# EAGLE design mkuBoard-044-3B (EAGLE 7.5.0)
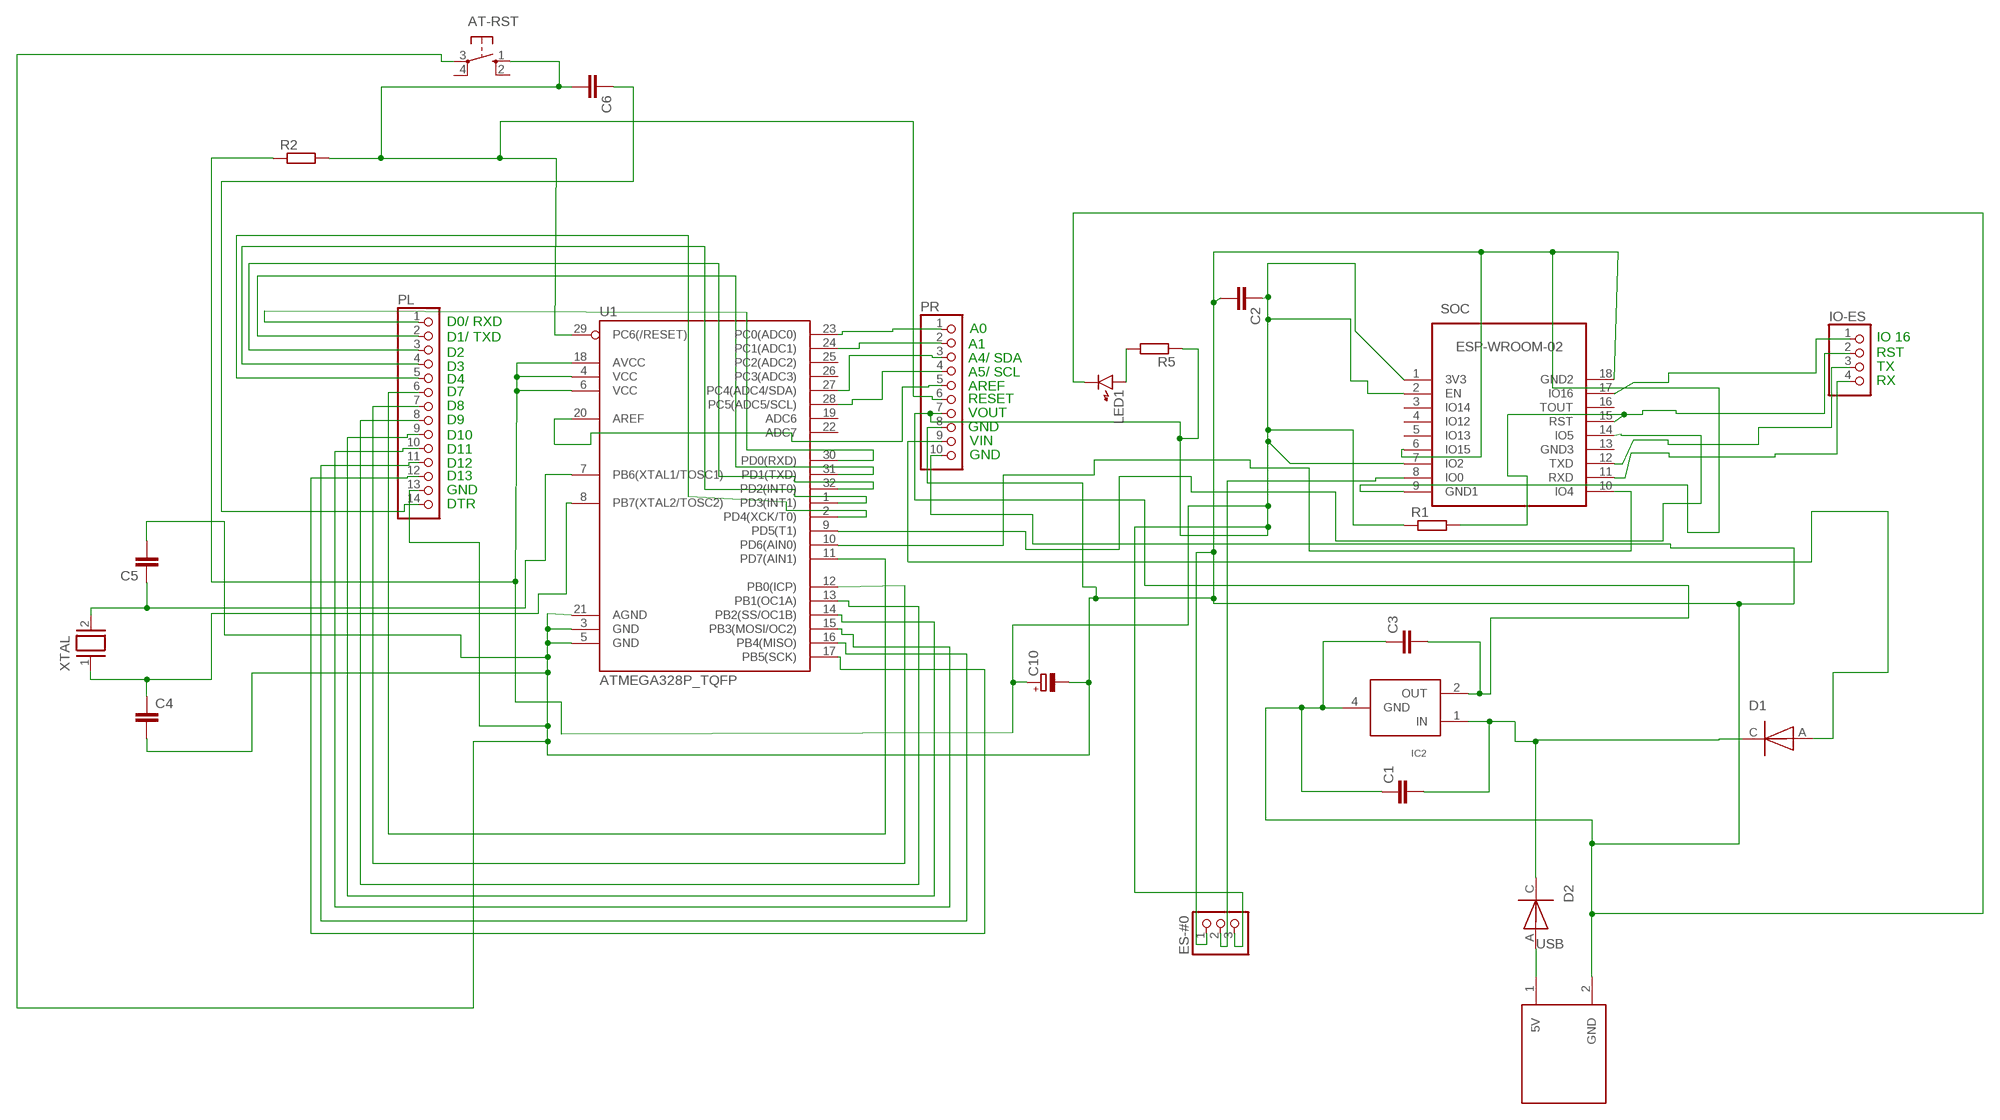
[diagram p0: schematic, sheet 1]

## Parts
AT-RST  10-XX  [B3F-10XX]
C1  C-EUC0603  [C0603]
C2  C-EUC0603  [C0603]
C3  C-EUC1206  [C1206]
C4  C-EUC0603  [C0603]
C5  C-EUC0603  [C0603]
C6  C-EUC0603  [C0603]
C10  CPOL-EU153CLV-0605  [153CLV-0605]
D1  DIODE-EX  [SOD80C]
D2  DIODE-EX  [SOD80C]
ES-#0  PINHD-1X3  [1X03]
IC2  NJM2845DL1  [NJM2845DL1-PKG]
IO-ES  PINHD-1X4  [1X04]
LED1  LED1608  [LED1608]
PL  PINHD-1X14  [1X14]
PR  PINHD-1X10  [1X10]
R1  R-EU_R0603  [R0603]
R2  R-EU_R0603  [R0603]
R5  R-EU_R0603  [R0603]
SOC  ESP-WROOM-02  ESP-WROOM-02-CP2FRONT  [FRONT-FACE-CP2]
U1  ATMEGA328P_TQFP  [TQFP32-08]
USB  USB-CUST-1  [USB-CUST-1-PKG]
XTAL  XTAL/S  [QS]

## Nets
N$1: ES-#0.2 SOC.8(IO0)
N$2: PL.1 U1.30(PD0(RXD))
N$3: SOC.14(IO5) U1.9(PD5(T1))
N$4: IO-ES.2 R1.2 SOC.15(RST)
N$5: C1.2 D1.C D2.C IC2.1(IN)
N$6: IO-ES.1 SOC.17(IO16)
N$7: D1.A PR.9
N$8: PR.3 U1.27(PC4(ADC4/SDA))
N$9: IO-ES.3 SOC.12(TXD)
N$10: IO-ES.4 SOC.11(RXD)
N$11: PR.4 U1.28(PC5(ADC5/SCL))
N$12: D2.A USB.1(5V)
N$16: C2.1 C3.2 C10.+ ES-#0.3 IC2.2(OUT) PR.7 R1.1 R2.1 R5.1 SOC.1(3V3) SOC.2(EN) SOC.7(IO2) U1.4(VCC) U1.6(VCC) U1.18(AVCC)
N$18: C6.1 PL.14
N$19: PL.2 U1.31(PD1(TXD))
N$20: PL.3 U1.32(PD2(INT0))
N$21: PL.4 U1.1(PD3(INT1))
N$22: PL.5 U1.2(PD4(XCK/T0))
N$23: LED1.A R5.2
N$24: SOC.10(IO4) U1.10(PD6(AIN0))
N$25: PL.6 U1.11(PD7(AIN1))
N$26: PL.7 U1.12(PB0(ICP))
N$27: PL.8 U1.13(PB1(OC1A))
N$28: PL.9 U1.14(PB2(SS/OC1B))
N$29: PL.10 U1.15(PB3(MOSI/OC2))
N$30: PL.11 U1.16(PB4(MISO))
N$31: PL.12 U1.17(PB5(SCK))
N$32: PR.1 U1.23(PC0(ADC0))
N$33: PR.2 U1.24(PC1(ADC1))
N$34: AT-RST.1(S) C6.2 PR.6 R2.2 U1.29(PC6(/RESET))
N$36: AT-RST.3(P) C1.1 C2.2 C3.1 C4.2 C5.2 C10.- ES-#0.1 IC2.4(GND) LED1.K PL.13 PR.8 PR.10 SOC.6(IO15) SOC.9(GND1) SOC.18(GND2) U1.3(GND) U1.5(GND) U1.21(AGND) USB.2(GND)
N$38: PR.5 U1.20(AREF)
N$40: C5.1 U1.7(PB6(XTAL1/TOSC1)) XTAL.2
N$41: C4.1 U1.8(PB7(XTAL2/TOSC2)) XTAL.1
Unconnected: AT-RST.2(S1) AT-RST.4(P1) SOC.3(IO14) SOC.4(IO12) SOC.5(IO13) SOC.13(GND3) SOC.16(TOUT) U1.19(ADC6) U1.22(ADC7) U1.25(PC2(ADC2)) U1.26(PC3(ADC3))

## Notes on the sheet
- D0/ RXD
- A0
- D1/ TXD | IO 16
- A1
- D2 | RST
- A4/ SDA
- D3 | TX
- A5/ SCL
- D4 | RX
- AREF
- D7
- RESET
- D8
- VOUT
- D9
- GND
- D10
- VIN
- D11
- GND
- D12
- D13
- GND
- DTR

## Library data of the parts
AT-RST = switch-omron:10-XX: OMRON SWITCH; MPN: B3F-1000; OC_FARNELL: 176432; OC_NEWARK: 36M3542
C1-C6 = resistor:C-EU: CAPACITOR, European symbol
C10 = rcl:CPOL-EU: POLARIZED CAPACITOR, European symbol
D1 D2 = diode-ex2:DIODE-EX
ES-#0 = pinhead:PINHD-1X3: PIN HEADER
IC2 = ic-cust-4:NJM2845DL1
IO-ES = pinhead:PINHD-1X4: PIN HEADER
LED1 = generic:LED: Generic LEDs
PL = pinhead:PINHD-1X14: PIN HEADER
PR = pinhead:PINHD-1X10: PIN HEADER
R1 R2 R5 = resistor:R-EU_: RESISTOR, European symbol
SOC = esp-wroom-02-CP2:ESP-WROOM-02-CP2: WiFi module - ESP-WROOM-02
U1 = SparkFun-DigitalIC:ATMEGA328P_TQFP; PROD_ID: IC-09069
USB = usb-cust-2:USB-CUST-1
XTAL = special:XTAL/S: CRYSTAL

## Board
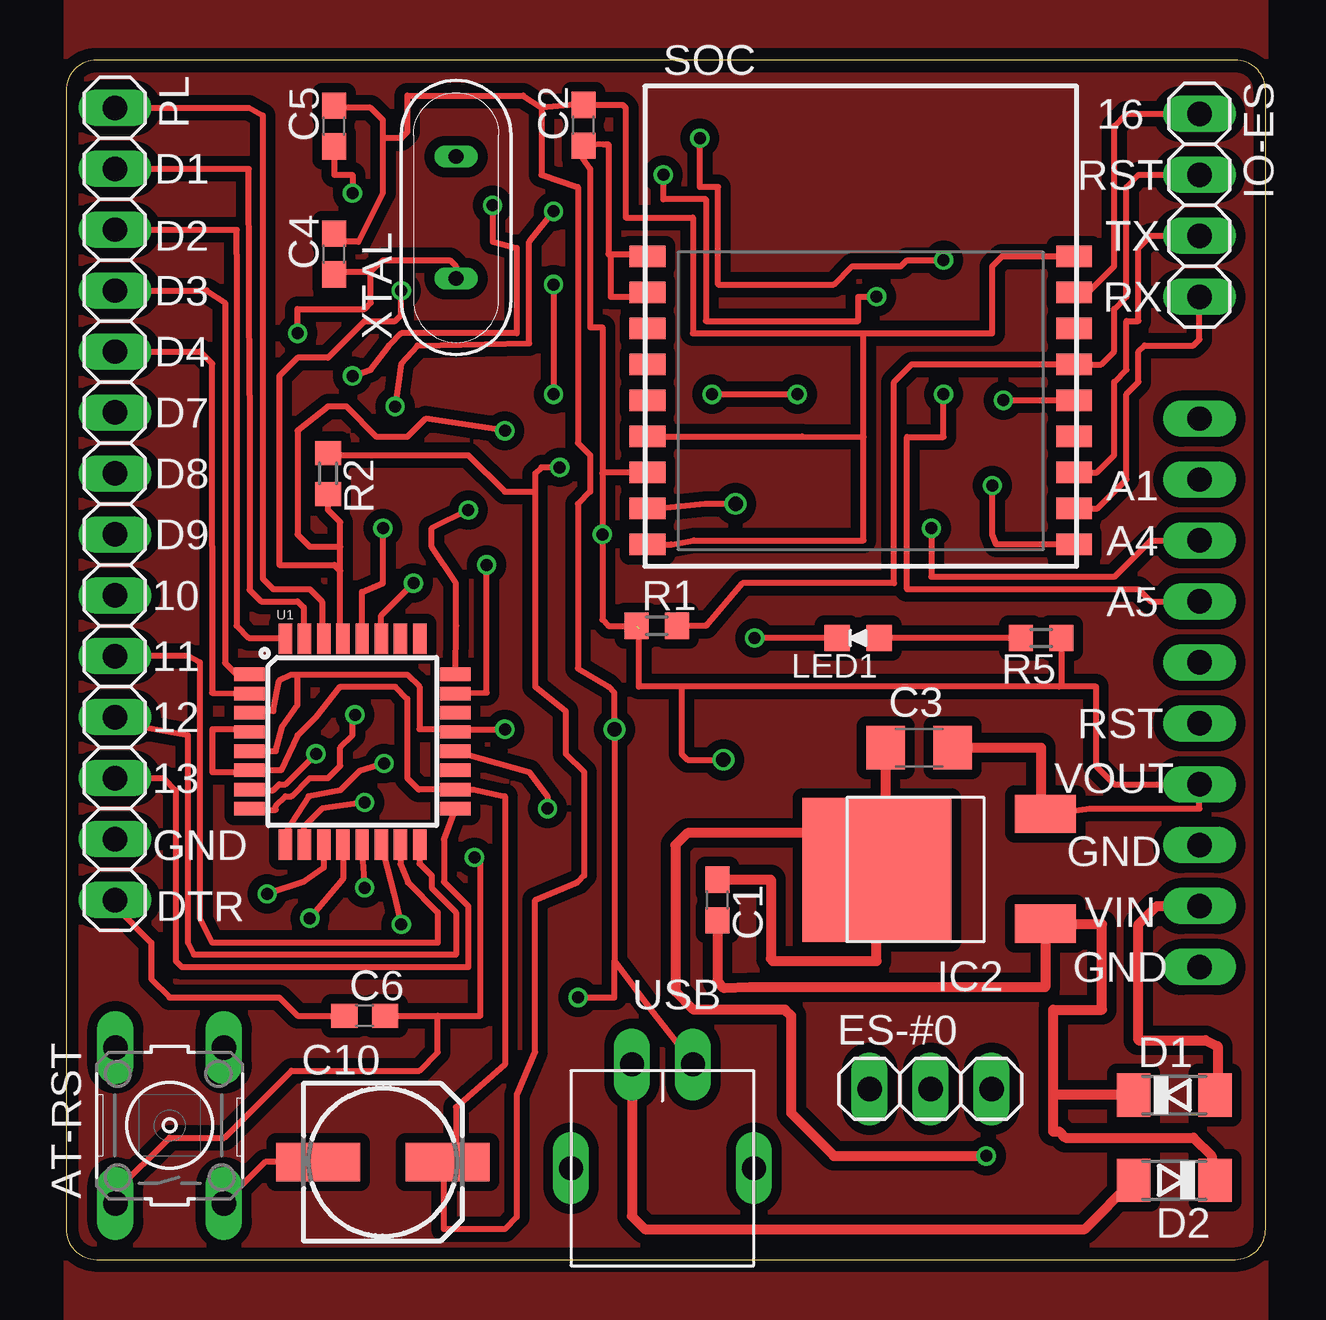
[diagram p1: board, top side]
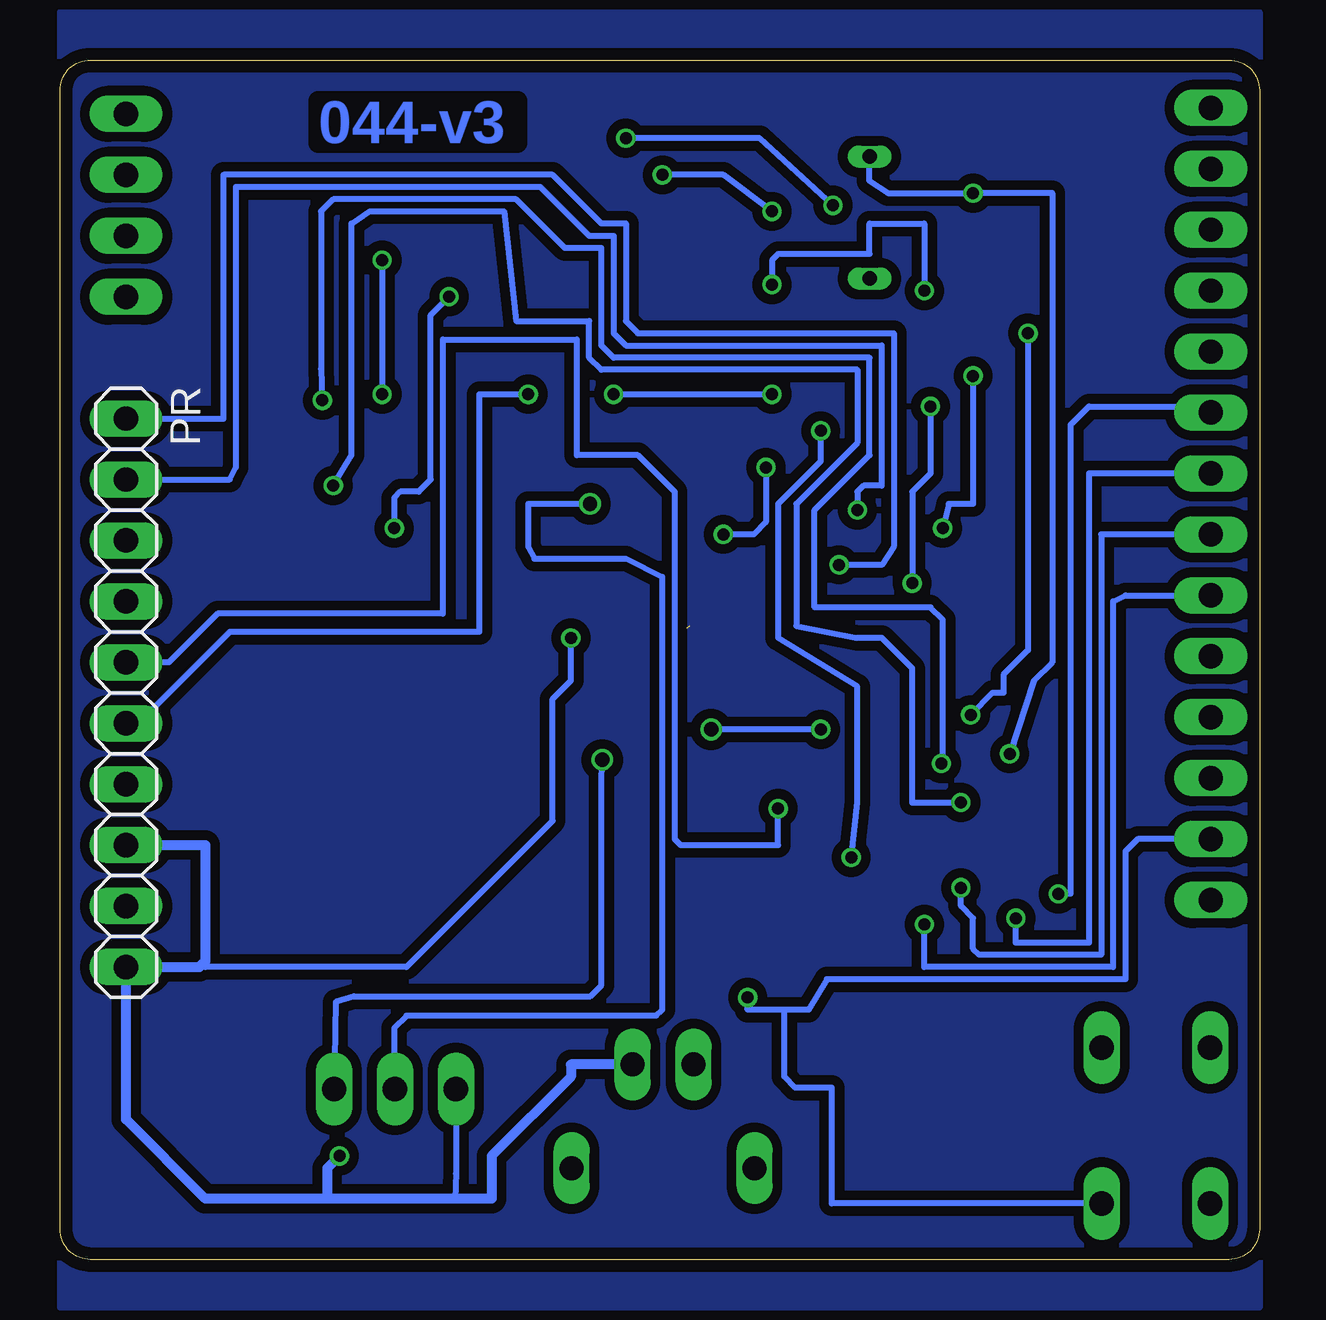
[diagram p2: board, bottom side, seen from below]

Size 50 x 50 mm. Coordinates in mm from the lower left corner, seen from the top.
Outline: 50,1.27 50,48.73 arc90 48.73,50 1.27,50 arc90 0,48.73 0,1.27 arc90 1.27,0 48.73,0 arc90 50,1.27
Copper layers (1*16): Top 0.035mm / dielectric 1.6mm / Bottom 0.035mm
Design rules "Elecrow_2-layer_PCB_eagle_rule": minimum track width 6mil, minimum drill 12mil, track to track 6mil, track to pad 6mil, pad to pad 6mil, via to via 8mil, smd to smd 0mil, copper to edge 20mil, drill to drill 10mil, minimum pad ring 6mil, minimum via ring 6mil, stop-mask expansion 0mil, vias tented up to drill 100mil, thermal gap 10mil

### Footprints (pad centres in the part's own frame; a part is rotated, then mirrored left to right if it is on the bottom)
B3F-10XX = drill 1.016 long: 1 -3.251,2.261; 2 3.251,2.261; 3 -3.251,-2.261; 4 3.251,-2.261
C0603 = smd 1.1 x 1: 1 -0.85,0; 2 0.85,0
C1206 = smd 1.6 x 1.8: 1 -1.4,0; 2 1.4,0
153CLV-0605 = smd 3.5 x 1.6: + 2.7,0; - -2.7,0
SOD80C = smd 1.4 x 1.8: A 1.7,0; C -1.7,0
1X03 = drill 1.016 long: 1 -2.54,0; 2 0,0; 3 2.54,0
NJM2845DL1-PKG = smd 2.54 x 1.6: 1 -4.27,2.254; 2 -4.27,-2.318 | smd 6.2 x 6: 4 2.746,0.016
1X04 = drill 1.016 long: 1 -3.81,0; 2 -1.27,0; 3 1.27,0; 4 3.81,0
LED1608 = smd 1.05 x 1.08: A -0.875,0; K 0.875,0
1X14 = drill 1.016 long: 1 -16.51,0; 2 -13.97,0; 3 -11.43,0; 4 -8.89,0; 5 -6.35,0; 6 -3.81,0; 7 -1.27,0; 8 1.27,0; 9 3.81,0; 10 6.35,0; 11 8.89,0; 12 11.43,0; 13 13.97,0; 14 16.51,0
1X10 = drill 1.016 long: 1 -11.43,0; 2 -8.89,0; 3 -6.35,0; 4 -3.81,0; 5 -1.27,0; 6 1.27,0; 7 3.81,0; 8 6.35,0; 9 8.89,0; 10 11.43,0
R0603 = smd 1 x 1.1: 1 -0.85,0; 2 0.85,0
FRONT-FACE-CP2 = smd 1.485 x 0.9: 1 -8.893,4.9; 2 -8.893,3.4; 3 -8.893,1.9; 4 -8.893,0.4; 5 -8.893,-1.1; 6 -8.893,-2.6; 7 -8.893,-4.1; 8 -8.893,-5.6; 9 -8.893,-7.1; 10 8.893,-7.1; 11 8.893,-5.6; 12 8.893,-4.1; 13 8.893,-2.6; 14 8.893,-1.1; 15 8.893,0.4; 16 8.893,1.9; 17 8.893,3.4; 18 8.893,4.9
TQFP32-08 = smd 1.27 x 0.559: 1 -4.293,2.8; 2 -4.293,2; 3 -4.293,1.2; 4 -4.293,0.4; 5 -4.293,-0.4; 6 -4.293,-1.2; 7 -4.293,-2; 8 -4.293,-2.8; 17 4.293,-2.8; 18 4.293,-2; 19 4.293,-1.2; 20 4.293,-0.4; 21 4.293,0.4; 22 4.293,1.2; 23 4.293,2; 24 4.293,2.8 | smd 0.559 x 1.27: 9 -2.8,-4.293; 10 -2,-4.293; 11 -1.2,-4.293; 12 -0.4,-4.293; 13 0.4,-4.293; 14 1.2,-4.293; 15 2,-4.293; 16 2.8,-4.293; 25 2.8,4.293; 26 2,4.293; 27 1.2,4.293; 28 0.4,4.293; 29 -0.4,4.293; 30 -1.2,4.293; 31 -2,4.293; 32 -2.8,4.293
USB-CUST-1-PKG = drill 1 long: 1 -1.27,6.604; 2 1.27,6.604; 3 -3.81,2.286; 4 3.81,2.286
QS = drill 0.61 long: 1 -2.54,0; 2 2.54,0

### Placement (x,y rotation side)
AT-RST  4.32,5.59 90 top
C1  27.14,14.99 270 top
C2  21.57,47.28 90 top
C3  35.56,21.34 0 top
C4  11.18,41.91 90 top
C5  11.18,47.24 90 top
C6  12.45,10.16 0 top
C10  13.21,4.06 0 top
D1  46.19,6.86 0 top
D2  46.19,3.3 180 top
ES-#0  36.03,7.11 0 top
IC2  36.54,16.26 180 top
IO-ES  47.24,43.94 270 top
LED1  33.02,25.91 180 top
PL  2.03,31.5 270 top
PR  47.24,23.62 270 bottom
R1  24.62,26.42 0 top
R2  10.92,32.77 270 top
R5  40.64,25.91 180 top
SOC  33.13,36.91 0 top
U1  11.94,21.59 0 top
USB  24.86,1.52 0 top
XTAL  16.26,43.43 90 top

### Tracks (layer width: path | path; a pad name or v marks a point on that pad's centre or on a via)
N$1  (via drill 0.6)
  Top 0.254: v27.91,31.5 26.64,31.5 24.17,31.24 SOC.8
  Bottom 0.254: v27.91,31.5 30.48,31.5 30.48,29.72 30.23,29.21 26.42,29.21 24.89,28.45 24.89,10.41 25.15,10.16 35.56,10.16 36.07,9.65 36.07,7.15 ES-#0.2
N$2
  Top 0.254: PL.1 7.62,48.01 8.2,47.68 8.2,28.38 8.64,27.94 10.16,27.94 10.67,27.43 10.67,25.95 U1.30
N$3  (via drill 0.5)
  Top 0.152: 9.14,17.83 9.14,17.37 U1.9
  Top 0.254: v13.26,20.68 12.24,20.37 11.43,19.56 10.11,19.3 9.14,17.83 | v39.06,35.81 SOC.14
  Bottom 0.254: v39.06,35.81 39.12,37.13 39.12,43.69 38.61,44.2 30.99,44.2 28.96,42.16 27.43,42.16 27.43,38.1 26.92,37.59 16.26,37.59 16.26,33.53 18.54,31.24 18.54,27.18 13.72,27.18 13.21,26.67 13.21,20.73 v13.26,20.68
N$4
  Top 0.254: IO-ES.2 44.7,45.21 44.2,44.7 44.2,40.13 43.69,39.62 43.69,37.85 43.15,37.31 SOC.15 35.24,37.31 34.51,36.58 34.51,28.19 28.19,28.19 26.67,26.42 R1.2
N$5
  Top 0.406: C1.2 27.14,11.6 27.43,11.31 28.49,11.35 40.81,11.35 IC2.1 40.81,13.97 43.18,13.97 43.18,10.41 41.15,10.41 41.15,6.86 | D1.C 41.15,6.86 | 41.15,6.86 41.15,5.33 41.4,5.33 41.66,5.08 46.99,5.08 47.75,4.32 47.75,3.44 D2.C
N$6
  Top 0.254: SOC.17 42.59,40.31 43.69,41.4 43.69,47.24 44.2,47.75 IO-ES.1
N$7
  Top 0.406: PR.9 45.47,14.73 44.7,13.97 44.7,9.14 47.5,9.14 48.01,8.89 48.01,6.97 D1.A
N$8  (via drill 0.5)
  Top 0.254: v20.32,43.69 19.3,42.42 19.3,38.19 14.64,38.1 13.97,37.34 v13.72,35.56 | U1.27 13.14,26.85 v14.48,28.19 | PR.3 45.21,29.97 43.69,28.45 36.07,28.45 v36.07,30.48 | v33.78,40.13 33.02,40.13 33.02,39.12 26.67,39.12 26.67,44.2 24.89,44.2 v24.89,45.21
  Bottom 0.254: v20.32,43.69 22.35,45.21 v24.89,45.21 | v13.72,35.56 13.72,32.77 14.48,32 v14.48,28.19 | v36.07,30.48 36.07,31.75 35.81,32 35.05,32 34.54,32.51 34.54,39.37 v33.78,40.13
N$9
  Top 0.254: 41.58,32.81 SOC.12 42.97,32.81 43.69,33.53 43.69,36.58 44.2,37.08 44.2,39.12 44.7,39.12 44.7,42.16 45.21,42.67 IO-ES.3
N$10
  Top 0.254: SOC.11 42.99,31.31 44.2,32.51 44.2,36.07 44.7,36.58 44.7,37.85 44.96,38.1 46.99,38.1 47.24,38.35 IO-ES.4
N$11  (via drill 0.5)
  Top 0.254: U1.28 12.34,27.83 13.21,28.19 v13.21,30.48 | v11.94,36.83 12.7,37.08 13.46,38.1 13.97,38.61 18.8,38.61 18.8,42.16 17.78,42.42 v17.78,43.94 | v36.58,36.07 36.58,34.29 35.05,34.29 35.05,27.94 44.7,27.94 45.21,27.43 PR.4 | v36.58,41.66 35.05,41.66 34.8,41.4 32.77,41.4 32,40.64 27.18,40.64 27.18,44.7 26.42,44.7 v26.42,46.74
  Bottom 0.254: v17.78,43.94 20.83,46.74 v26.42,46.74 | v36.58,41.66 v36.58,36.07 | v11.94,36.83 11.94,31.5 12.95,31.5 v13.21,30.48
N$12
  Top 0.406: D2.A 42.46,1.27 24.13,1.27 23.59,1.81 USB.1
N$14
  pour Bottom (isolate 0.406, no thermals): 0,52 0,-2 50,-2 50,52
N$16  (via drill 0.5, 0.6)  (1 unrouted)
  Top 0.254: IC2.2 40.81,18.54 42.67,18.8 47.24,18.8 PR.7 43.69,19.81 42.93,20.57 42.93,23.88 41.4,23.88 | U1.4 7.75,22.1 6.1,22.1 6.1,20.32 7.58,20.32 U1.6 8.96,20.39 9.65,21.84 10.41,22.61 11.43,23.88 13.72,23.88 14.22,23.37 14.22,20.07 14.7,19.59 U1.18 16.99,19.59 18.29,19.3 18.29,8.13 16.26,6.35 16.26,4.41 C10.+ 15.75,3.46 15.75,1.27 18.29,1.27 18.8,1.78 18.8,6.86 19.56,8.64 19.56,14.99 21.34,15.75 21.59,16 21.59,20.32 20.83,21.08 20.83,22.86 19.56,23.88 19.56,32 | 24.08,41.66 SOC.1 24.13,41.91 22.61,41.91 | 22.61,41.91 22.61,46.48 22.39,46.48 C2.1 21.34,46.19 21.84,45.47 21.84,38.86 22.35,38.86 22.35,32.77 | SOC.2 23.9,40.13 22.71,40.13 22.71,41.81 22.61,41.91 | 22.35,32.77 v22.35,30.23 22.35,26.67 22.61,26.42 R1.1 | R2.1 11.01,33.53 16.76,33.53 18.29,32 19.56,32 | v20.57,33.02 19.81,33.02 19.56,32.77 19.56,32 | SOC.7 22.39,32.81 22.35,32.77 | 25.65,23.88 23.88,23.88 23.88,26.31 | 41.4,23.88 25.65,23.88 | 25.65,23.88 25.65,21.08 25.91,20.83 v27.4,20.83 | R5.1 41.49,23.96 41.4,23.88
  Top 0.406: C3.2 40.64,21.34 40.64,18.75 IC2.2
  Bottom 0.254: ES-#0.3 38.51,10.74 37.74,10.97 27.89,10.97 27.43,11.43 27.43,19.78 v27.4,20.83 | v20.57,33.02 20.57,30.73 21.08,30.23 v22.35,30.23
N$18
  Top 0.254: PL.14 2.03,14.73 3.56,13.21 3.56,11.68 4.32,10.92 8.89,10.92 9.65,10.16 C6.1
N$19
  Top 0.254: PL.2 7.62,45.47 7.65,36.04 7.65,27.91 8.13,27.43 9.65,27.43 9.91,27.18 9.91,25.91 U1.31
N$20
  Top 0.254: PL.3 7.11,42.93 7.11,41.92 7.11,26.42 7.62,25.91 9.11,25.91 U1.32
N$21
  Top 0.254: PL.4 5.87,40.39 6.63,39.88 6.63,24.87 7.11,24.38 U1.1
N$22
  Top 0.254: PL.5 5.59,37.85 6.1,37.34 6.1,29.72 6.09,23.62 U1.2
N$23
  Top 0.254: R5.2 LED1.A
N$24  (via drill 0.5)
  Top 0.254: SOC.10 38.77,29.81 38.61,30.23 v38.61,32.26 | v12.45,19.05 10.67,18.8 9.91,18.03 9.91,17.33 U1.10
  Bottom 0.254: v38.61,32.26 37.85,33.53 37.85,43.18 37.08,43.69 31.5,43.69 30.99,39.12 27.94,39.12 27.94,37.59 27.43,37.08 16.76,37.08 16.76,34.04 19.3,31.5 19.3,26.42 16.76,25.91 15.75,25.91 14.48,24.64 14.48,19.05 v12.45,19.05
N$25  (via drill 0.5)
  Top 0.254: U1.11 10.74,16.33 9.91,15.75 v8.38,15.24
  Bottom 0.254: 2.79,35.31 PL.6 2.29,35.56 7.11,35.56 7.87,34.8 7.87,15.24 v8.38,15.24
N$26  (via drill 0.5)
  Top 0.254: U1.12 11.54,15.86 v10.16,14.22
  Bottom 0.254: PL.7 7.11,32.77 7.11,13.21 10.16,13.21 v10.16,14.22
N$27  (via drill 0.5)
  Top 0.254: U1.13 12.34,16.91 v12.45,15.49
  Bottom 0.254: PL.8 6.6,30.23 6.6,12.7 11.68,12.7 11.94,12.95 11.94,14.22 12.45,14.73 v12.45,15.49
N$28  (via drill 0.5)
  Top 0.254: U1.14 13.65,15.31 v13.97,13.97
  Bottom 0.254: PL.9 5.59,27.69 6.1,27.43 6.1,12.19 13.97,12.19 v13.97,13.97
N$29
  Top 0.254: U1.15 13.94,16.48 14.26,15.72 15.49,14.48 15.49,13.21 6.1,13.21 5.59,14.22 5.59,24.89 5.08,25.15 PL.10
N$30
  Top 0.254: PL.11 2.29,22.35 5.08,21.84 5.08,13.21 5.33,12.7 16.26,12.7 16.26,14.48 15.24,15.49 15.24,16 14.73,16.51 U1.16
N$31
  Top 0.254: U1.17 15.75,17.5 15.75,15.75 16.76,14.73 16.76,12.19 4.83,12.19 4.57,12.45 4.57,19.56 4.06,20.07 PL.12
N$32  (via drill 0.5)
  Top 0.254: U1.23 17.53,23.62 v17.53,28.96
  Bottom 0.254: PR.1 43.18,35.05 43.18,45.21 29.46,45.21 27.43,43.18 26.42,43.18 26.42,39.12 25.91,38.61 15.24,38.61 15.24,29.72 15.75,28.96 v17.53,28.96
N$33  (via drill 0.5)
  Top 0.254: U1.24 16.26,26.42 16.26,28.19 15.24,29.72 15.24,30.48 v16.76,31.24
  Bottom 0.254: PR.2 42.93,32.51 42.67,33.02 42.67,44.7 29.97,44.7 27.94,42.67 26.92,42.67 26.92,38.61 26.42,38.1 15.75,38.1 15.75,32.26 16.51,32.26 16.76,32 v16.76,31.24
N$34  (via drill 0.5)
  Top 0.254: 11.48,25.83 U1.29 11.43,25.99 11.43,28.7 | v20.32,40.64 v20.32,36.07 | v26.92,36.07 v30.48,36.07 | v18.29,34.54 14.99,35.05 14.22,34.29 12.95,34.29 11.68,35.56 10.92,35.56 9.65,34.54 9.65,30.23 10.16,29.72 11.43,29.72 | C6.2 15.49,10.16 | AT-RST.1 2.06,2.82 4.32,5.08 6.6,5.08 9.4,7.87 14.73,7.87 15.49,8.64 15.49,10.16 | 15.49,10.16 17.27,10.16 17.27,16.51 v17.02,16.76 | 11.43,28.7 11.43,29.72 | 11.43,29.72 11.43,30.73 10.92,31.24 R2.2 | 11.43,28.7 11.18,28.96 8.89,28.96 8.89,36.83 9.65,37.59 10.92,37.59 12.45,39.12 13.72,39.12 13.97,39.37 v13.97,40.39
  Bottom 0.254: v30.48,36.07 32.51,36.07 32.51,26.16 42.93,26.16 46.74,22.35 PR.6 | v26.92,36.07 v20.32,36.07 | v17.02,16.76 16.76,19.05 16.76,23.88 20.07,25.91 20.07,31.5 18.29,33.27 v18.29,34.54 | v20.32,40.64 20.32,41.66 20.07,41.91 16.26,41.91 16.26,43.18 13.97,43.18 v13.97,40.39
N$35
  pour Top (isolate 0.406, no thermals): 0,54 0,-4 50,-4 50,54
N$36  (via drill 0.5, 0.6)
  Top 0.254: 33.24,38.61 26.13,38.61 26.13,43.43 23.33,43.43 23.33,48 23.2,48.13 C2.2 21.2,48.13 19.81,48.01 | 33.24,34.29 33.24,29.97 26.16,29.97 25.23,29.81 SOC.9 | 33.24,34.29 33.24,38.61 | SOC.6 30.68,34.31 33.24,34.29 | U1.3 7.71,22.86 8.64,22.86 8.89,24.13 9.4,24.38 9.65,24.38 | U1.5 8.74,21.19 9,22.21 9.65,23.11 9.65,24.38 | 19.81,48.01 19.05,48.51 14.22,48.51 14.22,46.99 13.97,46.74 13.21,46.74 | 13.21,46.74 13.21,44.45 12.19,42.42 11.52,42.42 C4.2 | 13.21,46.74 13.21,47.5 12.7,48.01 11.26,48.01 C5.2 | 33.24,38.61 38.61,38.61 38.61,41.4 39.01,41.81 SOC.18 | C10.- 8.31,4.06 AT-RST.3 | 9.65,24.38 14.22,24.38 14.73,23.88 14.73,22.1 16.12,22.1 U1.21 16.34,22.1 v18.29,22.1 | 19.81,48.01 19.81,45.21 21.34,44.7 21.34,34.04 21.84,33.53 21.84,32 21.34,31.5 21.34,24.64 22.61,23.88 22.86,23.62 v22.86,22.1 22.86,12.45 | 22.86,12.45 24.38,10.41 26.16,8.16 USB.2 | v21.34,10.92 22.86,10.92 22.86,12.45 | LED1.K v28.7,25.91
  Top 0.406: IC2.4 33.53,14.45 31.53,14.45 30.99,17.78 25.91,17.78 25.4,17.27 25.4,11.18 26.16,10.41 29.97,10.41 30.23,10.16 30.23,6.1 32,4.32 v38.35,4.32 | 34.16,15.08 IC2.4 | C1.1 29.38,15.84 29.38,12.53 29.46,12.45 33.78,12.45 33.78,14.7 IC2.4 | C3.1 34.16,16.6 IC2.4
  Bottom 0.254: ES-#0.1 33.49,3.59 33.53,2.54 | PL.13 5.08,17.53 5.59,17.02 5.59,11.68 18.03,11.68 18.8,10.41 19.81,10.41 | 19.81,10.41 21.34,10.41 v21.34,10.92 | AT-RST.3 17.83,2.34 17.83,7.16 19.36,7.16 19.81,7.62 19.81,10.41 | v18.29,22.1 v22.86,22.1 | 44.07,12.32 43.94,12.19 35.56,12.19 29.46,18.29 29.46,23.37 28.7,24.13 v28.7,25.91
  Bottom 0.406: USB.2 28.7,8.13 28.7,7.62 32,4.32 32,2.54 33.53,2.54 38.86,2.54 | 38.86,2.54 43.94,2.54 47.24,5.84 PR.10 44.2,12.19 44.07,12.32 43.94,12.45 43.94,17.27 PR.8 | v38.35,4.32 38.86,3.81 38.86,2.54
N$38  (via drill 0.5)
  Top 0.254: U1.20 16.63,21.08 19.3,20.32 20.07,19.3 v20.07,18.8
  Bottom 0.254: PR.5 45.47,24.89 43.43,26.92 34.04,26.92 34.04,38.35 28.45,38.35 28.45,33.53 25.91,33.53 24.38,32 24.38,17.53 24.13,17.27 20.07,17.27 v20.07,18.8
N$40  (via drill 0.5)
  Top 0.254: U1.7 7.61,19.56 8.64,19.56 8.89,19.81 9.14,19.81 v10.41,21.08 | v11.94,44.45 11.94,45.21 11.18,45.21 C5.1
  Bottom 0.254: XTAL.2 16.26,44.96 15.49,44.45 v11.94,44.45 8.64,44.45 8.64,24.89 9.4,24.13 v10.41,21.08
N$41  (via drill 0.5)
  Top 0.152: 7.77,18.75 U1.8
  Top 0.254: 7.77,18.75 8.74,18.75 8.74,18.9 9.14,19.3 9.4,19.3 10.16,20.07 10.92,20.07 11.43,20.57 11.43,21.34 11.94,21.84 11.94,22.61 v12.04,22.71 | v9.65,38.61 9.65,39.62 12.45,39.62 12.7,39.88 12.7,41.15 | 12.7,41.15 13.21,41.66 16,41.66 16.26,41.4 XTAL.1 | 12.7,41.15 11.26,41.15 C4.1
  Bottom 0.254: v9.65,38.61 9.65,25.4 10.67,24.38 10.67,23.62 11.12,23.62 v12.04,22.71

### Text on the board
Bottom: 044-v3
tNames: 16 | D1 | RST | D2 | TX | D3 | RX | D4 | D7 | D8 | A1 | D9 | A4 | 10 | A5 | 11 | 12 | RST | 13 | VOUT | GND | GND | DTR | VIN | GND